# EAGLE design MICS-2614_O3_Sensor_Breakout (EAGLE 6.5.0)
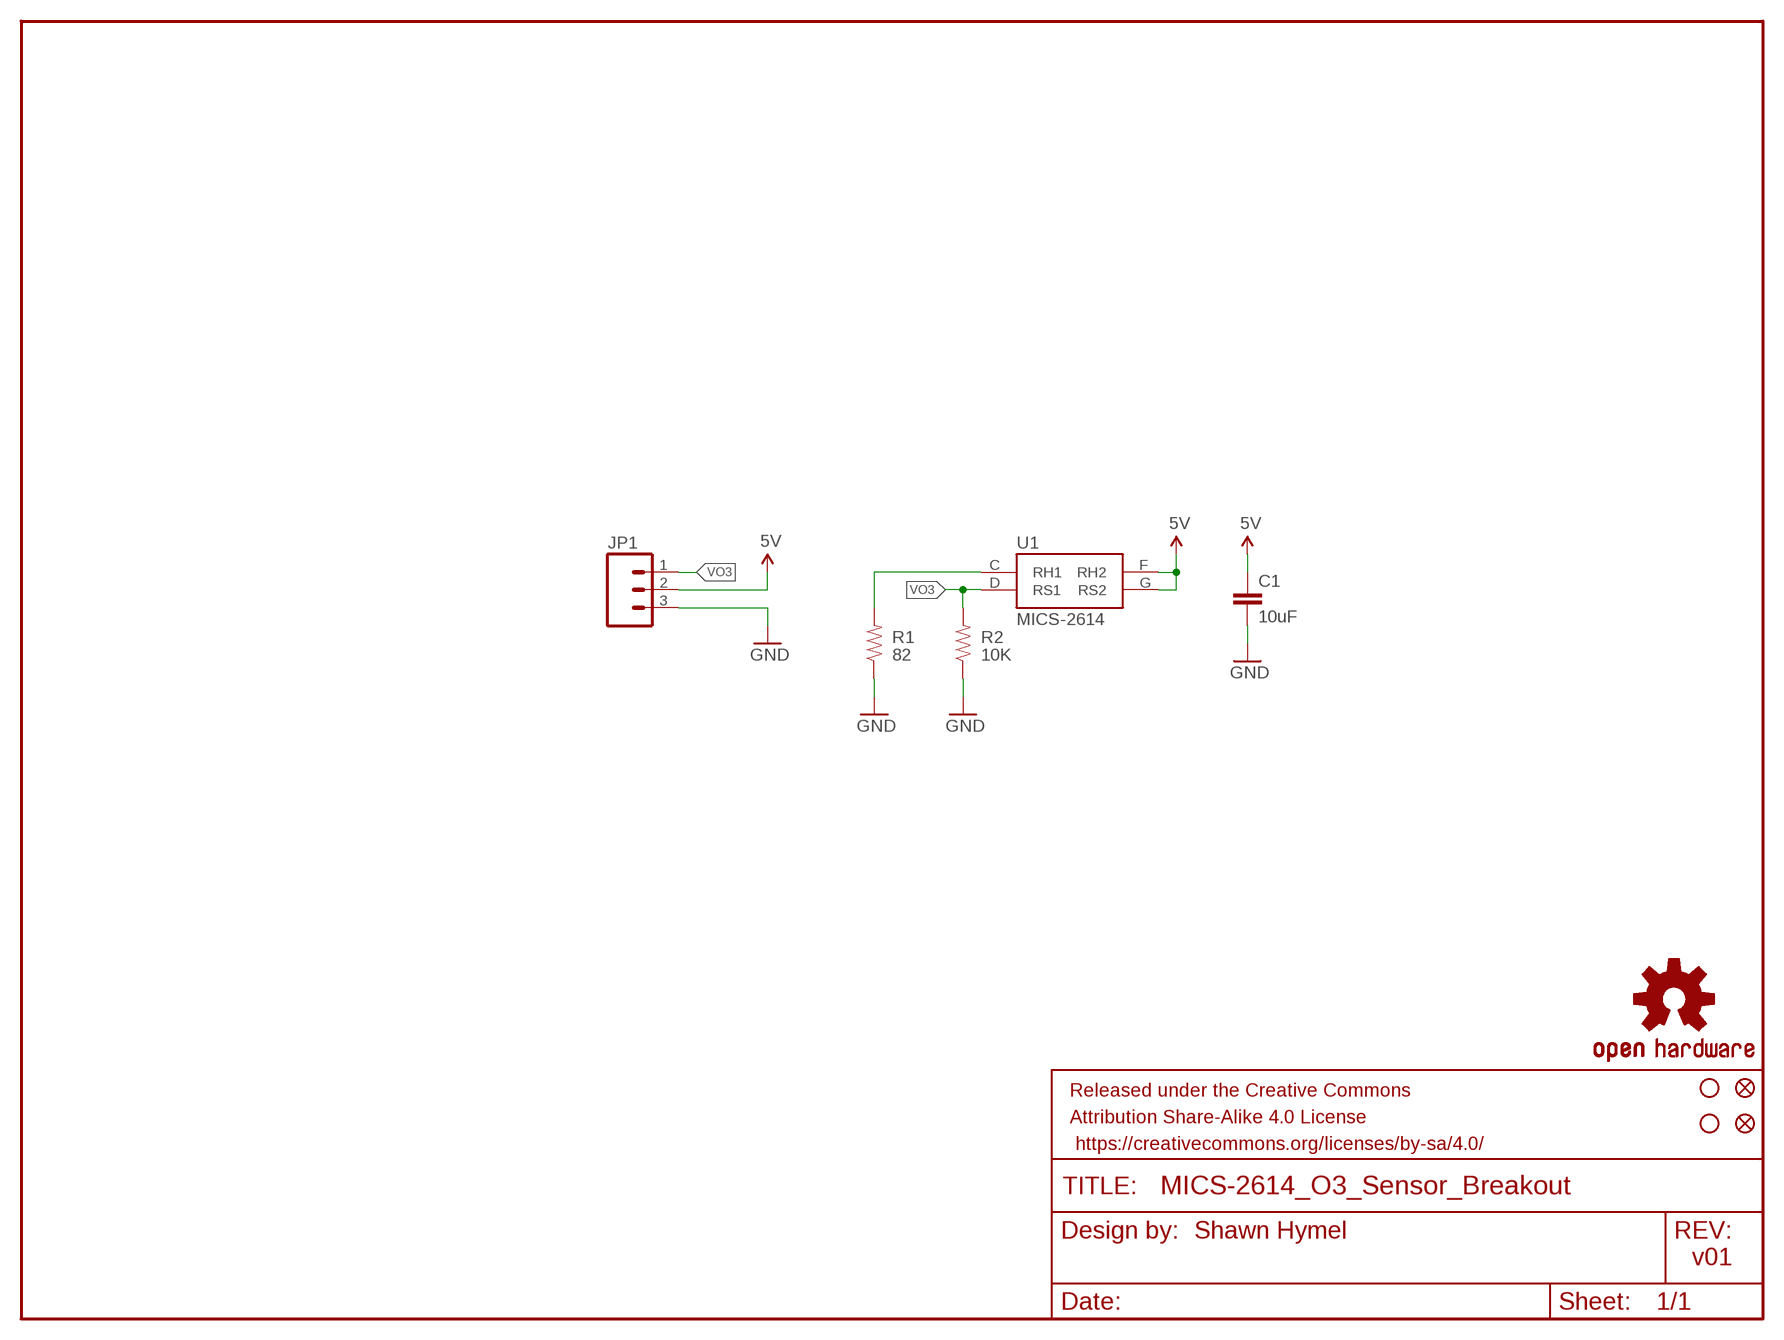
[diagram p0: schematic, sheet 1]

## Parts
C1  10uF  CAP0805  [0805]
FID1  FIDUCIAL1X2  [FIDUCIAL-1X2]
FID2  FIDUCIAL1X2  [FIDUCIAL-1X2]
FRAME1  FRAME-LETTER  [CREATIVE_COMMONS]
JP1  M03LOCK  [1X03_LOCK]
LOGO1  OSHW-LOGOS  [OSHW-LOGO-S]
R1  82  RESISTOR0805-RES  [0805]
R2  10K  10KOHM1/10W1%(0603)0603  [0603-RES]
STANDOFF3  STAND-OFF  [STAND-OFF]
STANDOFF5  STAND-OFF  [STAND-OFF]
U1  MICS-2614  [MICS_10-SMD]

## Nets
5V: C1.1 JP1.2 U1.F(RH2) U1.G(RS2)
GND: C1.2 JP1.3 R1.1 R2.1
N$1: R1.2 U1.C(RH1)
VO3: JP1.1 R2.2 U1.D(RS1)

## Notes on the sheet
- Shawn Hymel
- v01

## Library data of the parts
C1 = SparkFun-Capacitors:CAP: Capacitor Standard 0603 ceramic capacitor, and 0.1" leaded capacitor.; PROD_ID: CAP-11330
FID1 FID2 = SparkFun-Aesthetics:FIDUCIAL: Fiducial Alignment Points Various fiducial points for machine vision alignment.
FRAME1 = SparkFun-Aesthetics:FRAME-LETTER: Schematic Frame Standard 8.5x11 US Letter frame
JP1 = SparkFun-Connectors:M03: Header 3 Standard 3-pin 0.1" header. Use with straight break away headers (SKU : PRT-00116), right angle break away headers (PRT-00553), swiss pins (PRT-00743), machine pins (PRT-00117), and female headers (PRT-00115). Molex polarized connector foot print use with SKU : PRT-08232 with associated crimp pins and housings.
LOGO1 = SparkFun-Aesthetics:OSHW-LOGO: Open Source Hardware Logo This logo indicates the piece of hardware it is found on incorporates a OSHW license and/or adheres to the definition of open source hardware found here: http://freedomdefined.org/OSHW
R1 = SparkFun-Resistors:RESISTOR: Resistor Basic schematic elements and footprints for 0603, 1206, and PTH resistors.; DK_ID: 541-82.0CCT-ND
R2 = SparkFun-Resistors:10KOHM1/10W1%(0603): RES-00824; PROD_ID: RES-00824
STANDOFF3 STANDOFF5 = SparkFun-Electromechanical:STAND-OFF: #4 Stand Off This is the mechanical footprint for a #4 phillips button head screw. Use the keepout ring to avoid running the screw head into surrounding components. SKU : PRT-00447
U1 = SparkFun-Sensors:MICS-2614: Metal oxide MEMS ozone (O3) sensor in an SMD package.; PROD_ID: COMP-12309

## Board
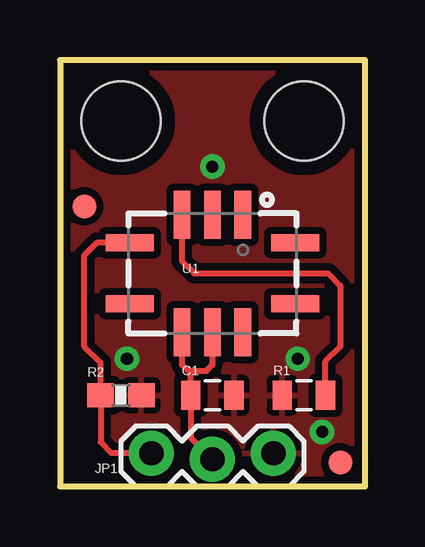
[diagram p1: board, top side]
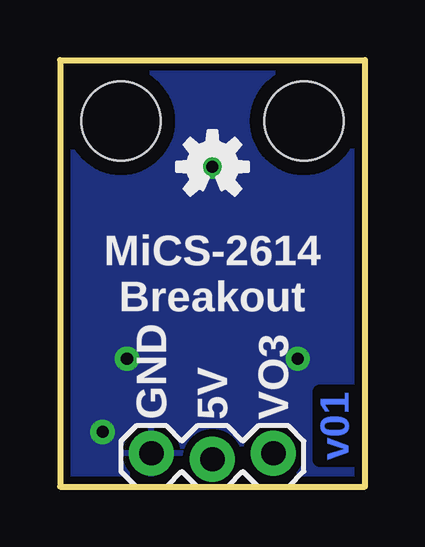
[diagram p2: board, bottom side, seen from below]

Size 12.7 x 17.78 mm. Coordinates in mm from the lower left corner, seen from the top.
Outline: 0,17.78 0,0 12.7,0 12.7,17.78 0,17.78
Copper layers (1*16): Top 0.035mm / dielectric 1.5mm / Bottom 0.035mm
Design rules "SparkFun-2-layer": minimum track width 7mil, minimum drill 15mil, track to track 8mil, track to pad 8mil, pad to pad 8mil, via to via 8mil, smd to smd 8mil, copper to edge 8mil, drill to drill 8mil, minimum pad ring 12mil, minimum via ring 10mil, stop-mask expansion 4mil, vias tented up to drill 20mil, thermal gap 10mil

### Footprints (pad centres in the part's own frame; a part is rotated, then mirrored left to right if it is on the bottom)
0805 = smd 0.8 x 1.2: 1 -0.9,0; 2 0.9,0
FIDUCIAL-1X2 = smd 1 x 1: 1 0,0
1X03_LOCK = drill 1.016 pad 1.88: 1 0,0.127; 2 2.54,-0.127; 3 5.08,0.127
0603-RES = smd 1.1 x 1: 1 -0.85,0; 2 0.85,0
STAND-OFF = hole 3.302: 0,0
MICS_10-SMD = smd 0.7 x 2: A 1.27,2.45; B 0,2.45; C -1.27,2.45; F -1.27,-2.45; G 0,-2.45; H 1.27,-2.45 | smd 2 x 0.7: D -3.45,1.27; E -3.45,-1.27; J 3.45,-1.27; K 3.45,1.27

### Placement (x,y rotation side)
C1  6.35,3.81 0 top
FID1  11.68,1.02 0 top
FID2  1.02,11.68 0 top
FRAME1  -15.24,-8.89 0 top  (outside the outline)
JP1  3.81,1.27 0 top
LOGO1  6.35,13.34 0 bottom
R1  10.16,3.81 0 top
R2  2.54,3.81 180 top
STANDOFF3  10.16,15.24 0 top
STANDOFF5  2.54,15.24 0 top
U1  6.35,8.89 0 top

### Tracks (layer width: path | path; a pad name or v marks a point on that pad's centre or on a via)
5V
  Top 0.254: U1.G 6.35,5.08 6.1,4.83 5.59,4.83 | U1.F 5.08,5.08 5.33,4.83 5.59,4.83 | 5.59,4.83 5.45,4.69 C1.1 5.45,2.04 JP1.2
GND  (via drill 0.51)
  other vias: 6.35,13.34 2.79,5.33 9.91,5.33 10.92,2.29
  pour Top (isolate 0.305): 0,17.78 12.7,17.78 12.7,0 0,0
  pour Bottom (isolate 0.305): 0,17.78 12.7,17.78 12.7,0 0,0
N$1
  Top 0.254: U1.C 5.08,9.4 5.59,8.89 11.18,8.89 11.68,8.38 11.68,5.84 11.06,5.22 R1.2
VO3
  Top 0.254: U1.D 1.52,10.16 1.02,9.65 1.02,5.84 1.69,5.17 R2.2 1.69,1.87 2.16,1.4 JP1.1

### Text on the board
Bottom: v01
bPlace: MiCS-2614 / Breakout | VO3 | 5V | GND
tDocu: Shawn Hymel